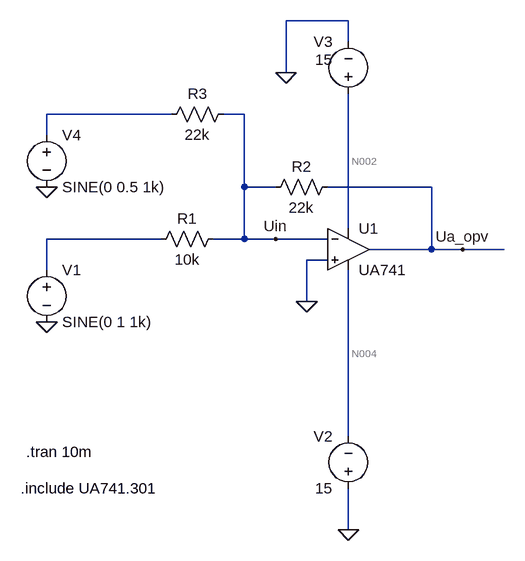
[diagram p0: schematic labor02_addiererMitOPV.asc]
labor02_addiererMitOPV.asc, the LTspice schematic file:
Version 4
SHEET 1 1368 708
WIRE -80 -96 -176 -96
WIRE -80 -64 -80 -96
WIRE -176 -16 -176 -96
WIRE -352 48 -544 48
WIRE -240 48 -272 48
WIRE -544 80 -544 48
WIRE -240 160 -240 48
WIRE -192 160 -240 160
WIRE 48 160 -112 160
WIRE -80 224 -80 16
WIRE -368 240 -544 240
WIRE -240 240 -240 160
WIRE -240 240 -288 240
WIRE -192 240 -240 240
WIRE -112 240 -192 240
WIRE 48 256 48 160
WIRE 48 256 -48 256
WIRE 96 256 48 256
WIRE 160 256 96 256
WIRE -112 272 -144 272
WIRE -544 288 -544 240
WIRE -144 336 -144 272
WIRE -80 544 -80 288
WIRE -80 688 -80 624
FLAG -544 368 0
FLAG -176 -16 0
FLAG -144 336 0
FLAG 96 256 Ua_opv
FLAG -192 240 Uin
FLAG -80 688 0
FLAG -544 160 0
SYMBOL voltage -544 272 R0
WINDOW 123 0 0 Left 0
WINDOW 39 0 0 Left 0
SYMATTR InstName V1
SYMATTR Value SINE(0 1 1k)
SYMBOL voltage -80 32 R180
WINDOW 0 24 96 Left 2
WINDOW 3 24 68 Left 2
WINDOW 123 0 0 Left 0
WINDOW 39 0 0 Left 0
SYMATTR InstName V3
SYMATTR Value 15
SYMBOL voltage -80 640 R180
WINDOW 0 24 96 Left 2
WINDOW 3 24 16 Left 2
WINDOW 123 0 0 Left 0
WINDOW 39 0 0 Left 0
SYMATTR InstName V2
SYMATTR Value 15
SYMBOL res -272 224 R90
WINDOW 0 0 56 VBottom 2
WINDOW 3 32 56 VTop 2
SYMATTR InstName R1
SYMATTR Value 10k
SYMBOL res -96 144 R90
WINDOW 0 0 56 VBottom 2
WINDOW 3 32 56 VTop 2
SYMATTR InstName R2
SYMATTR Value 22k
SYMBOL OpAmps\\opamp2 -80 192 R0
SYMATTR InstName U1
SYMATTR Value UA741
SYMBOL voltage -544 64 R0
WINDOW 123 0 0 Left 0
WINDOW 39 0 0 Left 0
SYMATTR InstName V4
SYMATTR Value SINE(0 0.5 1k)
SYMBOL res -256 32 R90
WINDOW 0 0 56 VBottom 2
WINDOW 3 32 56 VTop 2
SYMATTR InstName R3
SYMATTR Value 22k
TEXT -584 624 Left 2 !.include UA741.301
TEXT -576 568 Left 2 !.tran 10m

The netlist it stands for:
* labor02_addiererMitOPV.asc
V1 N003 0 SINE(0 1 1k)
V3 N002 0 15
V2 0 N004 15
R1 Uin N003 10k
R2 Ua_opv Uin 22k
XU1 0 Uin N002 N004 Ua_opv UA741  ; pins In+ In- V+ V- OUT
V4 N001 0 SINE(0 0.5 1k)
R3 Uin N001 22k
.include UA741.301
.tran 10m
.backanno
.end

* Results of the author's LTspice run, read from the files saved beside the schematic
* Operating Point, zero values left out:
*   V(n002) = 15 V
*   V(n004) = -15 V
*   V(uin) = 11.18 µV
*   V(ua_opv) = 1.802 mV
*   I(R3) = 508 pA
*   I(R2) = 81.38 nA
*   I(R1) = 1.118 nA
*   I(V4) = 508 pA
*   I(V2) = -1.667 mA
*   I(V3) = -1.667 mA
*   I(V1) = 1.118 nA
*   Ix(u1:1) = 79.74 nA
*   Ix(u1:2) = 79.76 nA
*   Ix(u1:3) = 1.667 mA
*   Ix(u1:4) = -1.667 mA
*   Ix(u1:5) = -81.38 nA
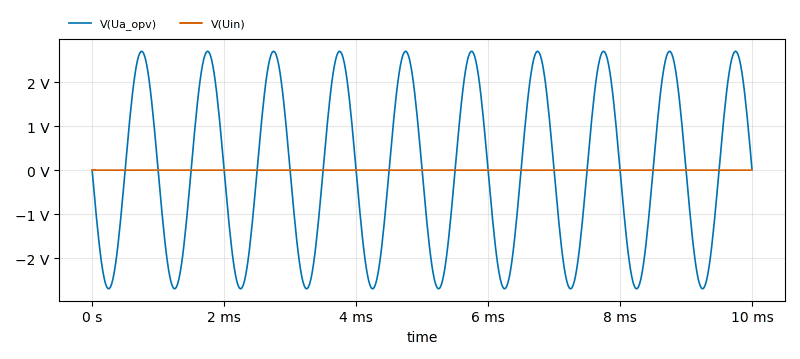
[diagram p1: Transient Analysis of labor02_addiererMitOPV.asc, plotted from the saved traces]
* Transient Analysis, 1 run:
*   V(Ua_opv): min -2.696 V, max 2.699 V, average 1.801 mV, rms 1.907 V, last 12.3 mV
*   V(Uin): min -2.473 mV, max 2.497 mV, average 11.06 µV, rms 1.757 mV, last 2.497 mV